# EAGLE design strip (EAGLE 9.2.0)
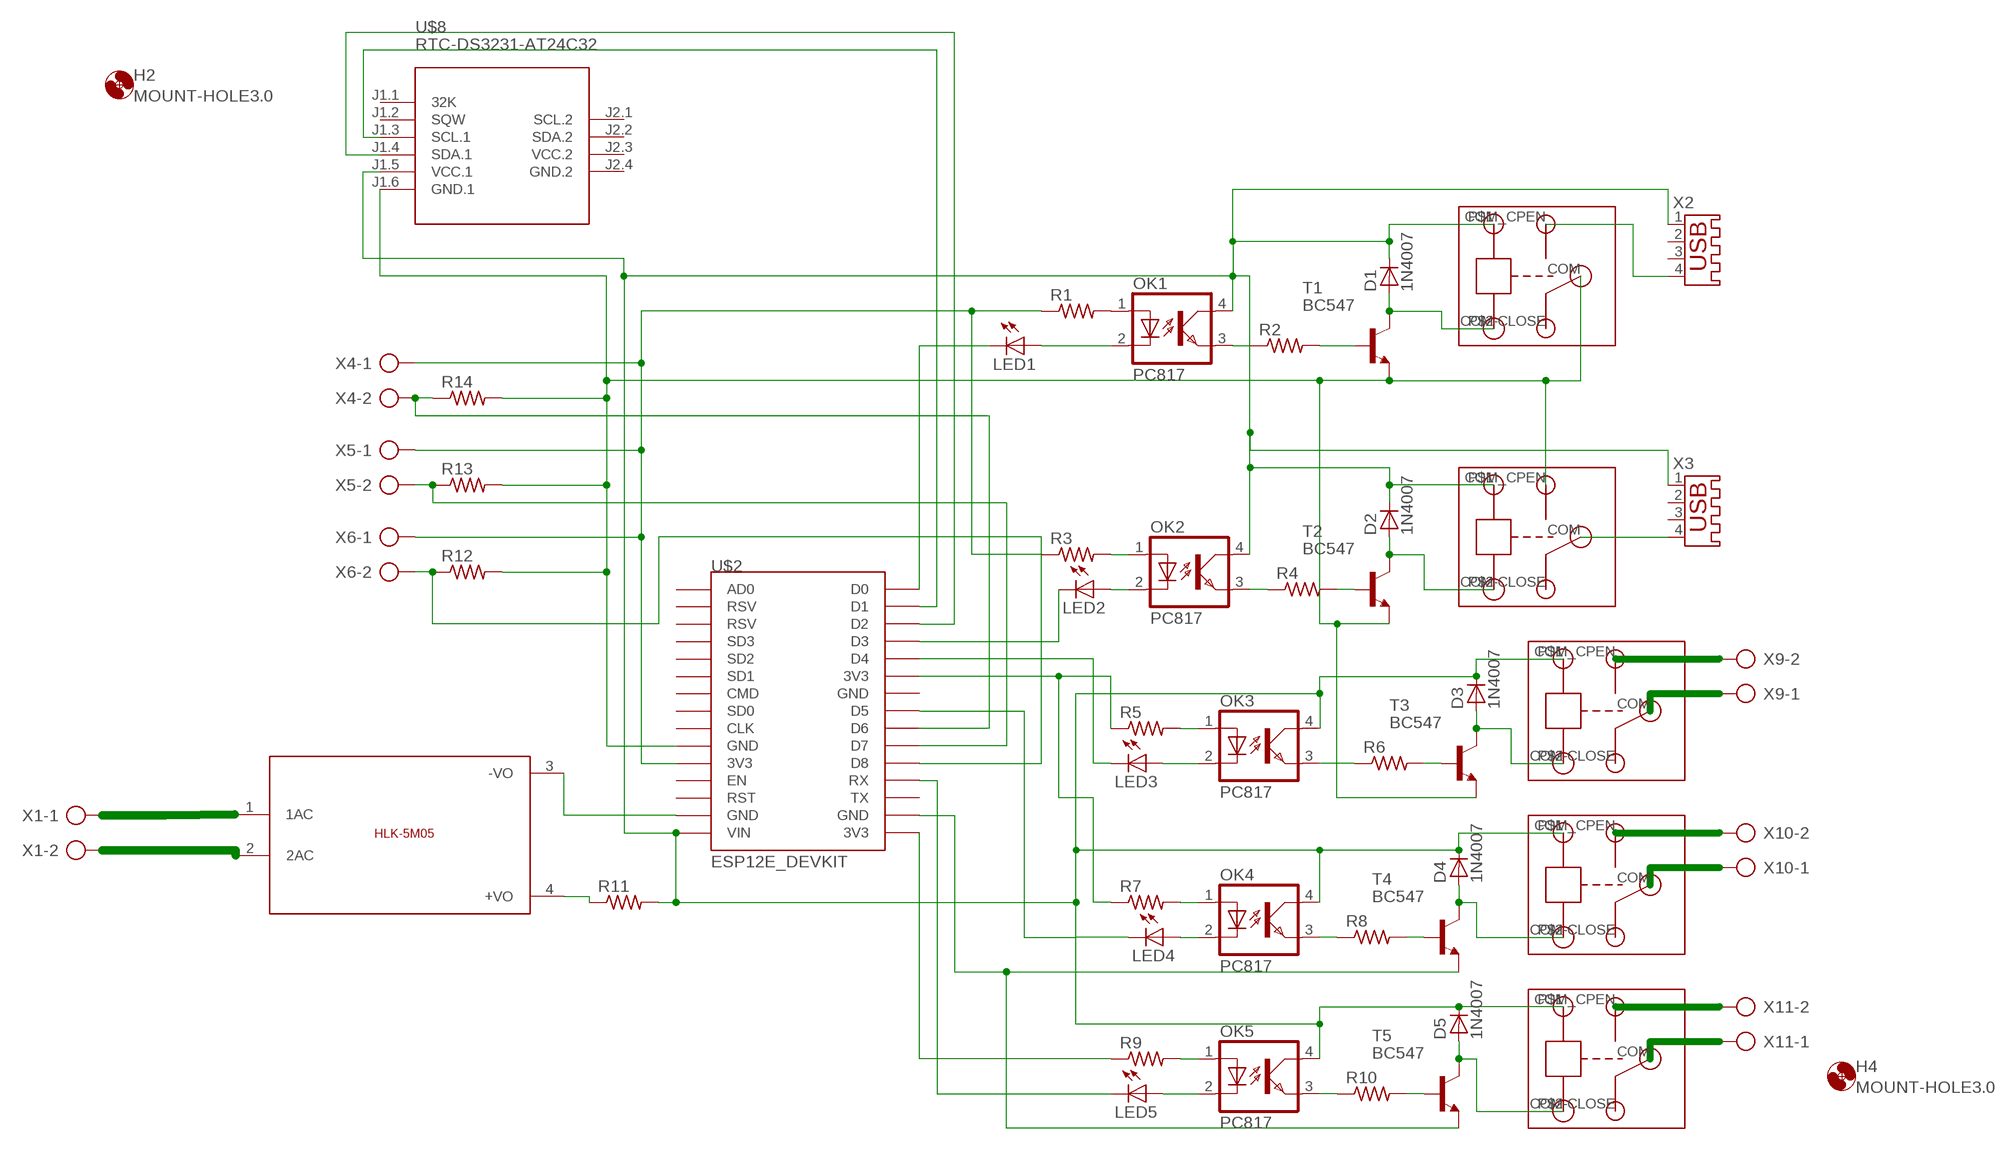
[diagram p0: schematic, sheet 1]

## Parts
D1  1N4007  [SMA]
D2  1N4007  [SMA]
D3  1N4007  [SMA]
D4  1N4007  [SMA]
D5  1N4007  [SMA]
H2  MOUNT-HOLE3.0  [3,0]
H4  MOUNT-HOLE3.0  [3,0]
LED1  LED3MM  [LED3MM]
LED2  LED3MM  [LED3MM]
LED3  LED3MM  [LED3MM]
LED4  LED3MM  [LED3MM]
LED5  LED3MM  [LED3MM]
OK1  PC817  [DIL04]
OK2  PC817  [DIL04]
OK3  PC817  [DIL04]
OK4  PC817  [DIL04]
OK5  PC817  [DIL04]
R1  R-US_0204/5  [0204/5]
R2  R-US_0204/5  [0204/5]
R3  R-US_0204/5  [0204/5]
R4  R-US_0204/5  [0204/5]
R5  R-US_0204/5  [0204/5]
R6  R-US_0204/5  [0204/5]
R7  R-US_0204/5  [0204/5]
R8  R-US_0204/5  [0204/5]
R9  R-US_0204/5  [0204/5]
R10  R-US_0204/5  [0204/5]
R11  R-US_0204/5  [0204/5]
R12  R-US_0204/5  [0204/5]
R13  R-US_0204/5  [0204/5]
R14  R-US_0204/5  [0204/5]
T1  BC547  [TO92]
T2  BC547  [TO92]
T3  BC547  [TO92]
T4  BC547  [TO92]
T5  BC547  [TO92]
U$1  5VDC/5W  HLK-5M05  [HLK-5M05]
U$2  ESP12E_DEVKIT  [ESP12E_DEVKIT]
U$3  RELAY  [RELAY]
U$4  RELAY  [RELAY]
U$5  RELAY  [RELAY]
U$6  RELAY  [RELAY]
U$7  RELAY  [RELAY]
U$8  RTC-DS3231-AT24C32  [RTC-DS3231-AT24C32]
X1  AK300/2  [AK300/2]
X2  USB-A003  [USB-A003]
X3  USB-A003  [USB-A003]
X4  AK300/2  [AK300/2]
X5  AK300/2  [AK300/2]
X6  AK300/2  [AK300/2]
X9  AK300/2  [AK300/2]
X10  AK300/2  [AK300/2]
X11  AK300/2  [AK300/2]

## Nets
N$1: U$1.1(1AC) X1.1
N$2: U$1.2(2AC) X1.2
N$3: R11.1 U$1.4(+VO)
N$4: U$1.3(-VO) U$2.GND@1(GND)
N$5: LED1.A OK1.2(C)
N$6: LED1.K(C) U$2.D0
N$7: OK1.1(A) R1.2
N$8: R1.1 R3.1 U$2.3V3@0(3V3) X4.1 X5.1 X6.1
N$9: D1.K(C) D2.K(C) D3.K(C) D4.K(C) D5.K(C) OK1.4(COL) OK2.4(COL) OK3.4(COL) OK4.4(COL) OK5.4(COL) R11.2 U$2.VIN U$3.P$1(IN) U$4.P$1(IN) U$5.P$1(IN) U$6.P$1(IN) U$7.P$1(IN) U$8.J1.5(VCC.1) X2.1 X3.1
N$10: OK1.3(EMIT) R2.1
N$11: R2.2 T1.2(B)
N$12: R12.2 R13.2 R14.2 T1.1(E) T2.1(E) T3.1(E) U$2.GND@0(GND) U$3.COM U$4.COM_CPEN(COM-OPEN) U$8.J1.6(GND.1)
N$13: D1.A T1.3(C) U$3.P$2(GND)
N$14: U$7.COM_CPEN(COM-OPEN) X11.2
N$15: U$7.COM X11.1
N$16: U$6.COM_CPEN(COM-OPEN) X10.2
N$17: U$6.COM X10.1
N$18: U$5.COM_CPEN(COM-OPEN) X9.2
N$19: U$5.COM X9.1
N$20: U$4.COM X3.4
N$21: R12.1 U$2.D8 X6.2
N$22: U$3.COM_CPEN(COM-OPEN) X2.4
N$23: R13.1 U$2.D7 X5.2
N$24: LED2.A OK2.2(C)
N$25: LED2.K(C) U$2.D3
N$26: OK2.1(A) R3.2
N$27: OK2.3(EMIT) R4.1
N$28: R4.2 T2.2(B)
N$29: D2.A T2.3(C) U$4.P$2(GND)
N$30: LED3.A OK3.2(C)
N$31: LED3.K(C) U$2.D4
N$32: OK3.1(A) R5.2
N$33: OK5.1(A) R9.2
N$34: OK3.3(EMIT) R6.1
N$35: R6.2 T3.2(B)
N$36: D3.A T3.3(C) U$5.P$2(GND)
N$37: LED4.A OK4.2(C)
N$38: OK4.1(A) R7.2
N$39: R5.1 R7.1 U$2.3V3@1(3V3)
N$40: OK4.3(EMIT) R8.1
N$41: R8.2 T4.2(B)
N$42: D4.A T4.3(C) U$6.P$2(GND)
N$43: T4.1(E) T5.1(E) U$2.GND@3(GND)
N$44: OK5.3(EMIT) R10.1
N$45: R10.2 T5.2(B)
N$46: D5.A T5.3(C) U$7.P$2(GND)
N$47: LED5.A OK5.2(C)
N$48: LED4.K(C) U$2.D5
N$49: U$2.D1 U$8.J1.3(SCL.1)
N$50: LED5.K(C) U$2.RX
N$51: R9.1 U$2.3V3@2(3V3)
N$52: U$2.D2 U$8.J1.4(SDA.1)
N$53: R14.1 U$2.D6 X4.2
Unconnected: U$2.AD0 U$2.CLK U$2.CMD U$2.EN U$2.GND@2(GND) U$2.RST U$2.RSV@0(RSV) U$2.RSV@1(RSV) U$2.SD0 U$2.SD1 U$2.SD2 U$2.SD3 U$2.TX U$3.COM-CLOSE U$4.COM-CLOSE U$5.COM-CLOSE U$6.COM-CLOSE U$7.COM-CLOSE U$8.J1.1(32K) U$8.J1.2(SQW) U$8.J2.1(SCL.2) U$8.J2.2(SDA.2) X2.2 X2.3 X3.2 X3.3

## Power pins joined to a net without a drawn wire
GND.2: U$8.J2.4(GND.2)
VCC.2: U$8.J2.3(VCC.2)

## Library data of the parts
D1-D5 = casovac:1N4007
H2 H4 = holes:MOUNT-HOLE: MOUNTING HOLE with drill center marker
LED1-LED5 = led:LED: LED OSRAM: - CHIPLED LG R971, LG N971, LY N971, LG Q971, LY Q971, LO R971, LY R971 LH N974, LH R974 LS Q976, LO Q976, LY Q976 LO Q996 - Hyper CHIPLED LW Q18S LB Q993, LB Q99A, LB R99A - SideLED LS A670, LO A670, LY A670, LG A670, LP A670 LB A673, LV A673, LT A673, LW A673 LH A674 LY A675 LS A676, LA A676, LO A676, LY A676, LW A676 LS A679, LY A679, LG A679 - Hyper Micro SIDELED® LS Y876, LA Y876, LO Y876, LY Y876 LT Y87S - SmartLED LW L88C, LW L88S LB L89C, LB L89S, LG L890 LS L89K, LO L89K, LY L89K LS L896, LA L896, LO L896, LY L896 - TOPLED LS T670, LO T670, LY T670, LG T670, LP T670 LSG T670, LSP T670, LSY T670, LOP T670, LYG T670 LG T671, LOG T671, LSG T671 LB T673, LV T673, LT T673, LW T673 LH T674 LS T676, LA T676, LO T676, LY T676, LB T676, LH T676, LSB T676, LW T676 LB T67C, LV T67C, LT T67C, LS T67K, LO T67K, LY T67K, LW E67C LS E67B, LA E67B, LO E67B, LY E67B, LB E67C, LV E67C, LT E67C LW T67C LS T679, LY T679, LG T679 LS T770, LO T770, LY T770, LG T770, LP T770 LB T773, LV T773, LT T773, LW T773 LH T774 LS E675, LA E675, LY E675, LS T675 LS T776, LA T776, LO T776, LY T776, LB T776 LHGB T686 LT T68C, LB T68C - Hyper Mini TOPLED® LB M676 - Mini TOPLED Santana® LG M470 LS M47K, LO M47K, LY M47K Source: http://www.osram.convergy.de LUXEON: - LUMILED® LXK2-PW12-R00, LXK2-PW12-S00, LXK2-PW14-U00, LXK2-PW14-V00 LXK2-PM12-R00, LXK2-PM12-S00, LXK2-PM14-U00 LXK2-PE12-Q00, LXK2-PE12-R00, LXK2-PE12-S00, LXK2-PE14-T00, LXK2-PE14-U00 LXK2-PB12-K00, LXK2-PB12-L00, LXK2-PB12-M00, LXK2-PB14-N00, LXK2-PB14-P00, LXK2-PB14-Q00 LXK2-PR12-L00, LXK2-PR12-M00, LXK2-PR14-Q00, LXK2-PR14-R00 LXK2-PD12-Q00, LXK2-PD12-R00, LXK2-PD12-S00 LXK2-PH12-R00, LXK2-PH12-S00 LXK2-PL12-P00, LXK2-PL12-Q00, LXK2-PL12-R00 Source: www.luxeon.com KINGBRIGHT: KA-3528ASYC Source: www.kingbright.com
OK1-OK5 = optocoupler:PC817: SHARP OPTO COUPLER; MPN: PC817X4J000F; OC_FARNELL: 9707727; OC_NEWARK: 97K7059
R1-R10 R12-R14 = resistor:R-US_: RESISTOR, American symbol
R11 = rcl:R-US_: RESISTOR, American symbol; SPICEPREFIX: R
T1-T5 = transistor-neu-to92:BC547: NPN TRANSISTOR
U$1 = HLK-5M05:HLK-5M05: HLK-5M05 is an 5Volt/5W smps developed by HI-LINK; SIZE: 23x38(mm)
U$2 = ESP12E_DEVKIT:ESP12E_DEVKIT: ESP12E DEVKIT BOARD
U$3-U$7 = RELAY:RELAY
U$8 = diy-modules:RTC-DS3231-AT24C32: RTC Module with Battery and EEPROM based on DS3231 and AT24C32 chips Tutorial can be found here: https://edwardmallon.wordpress.com/2014/05/21/using-a-cheap-3-ds3231-rtc-at24c32-eeprom-from-ebay/ Click here to find device on ebay.com <http://www.ebay.com/sch/DS3231+AT24C32+module>
X1 X4-X6 X9-X11 = con-ptr500:AK300/2: CONNECTOR; OC_FARNELL: unknown; OC_NEWARK: unknown
X2 X3 = con-yamaichi:USB-A003: USB connector; OC_FARNELL: unknown; OC_NEWARK: unknown

## Board
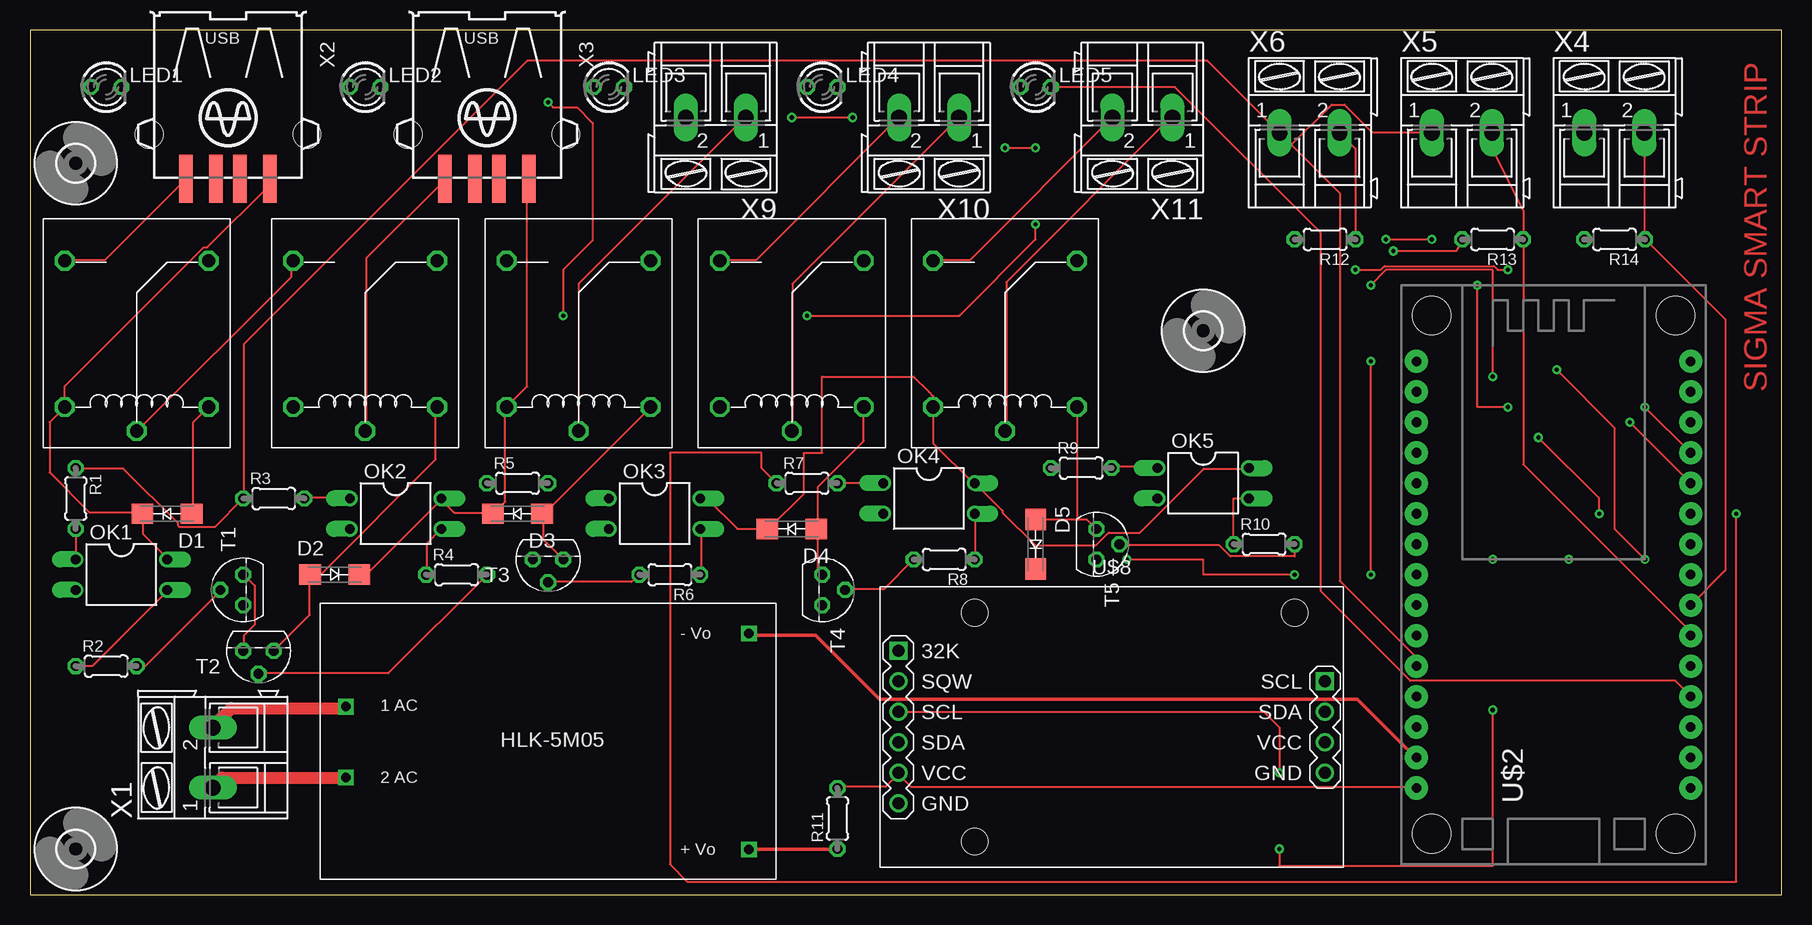
[diagram p1: board, top side]
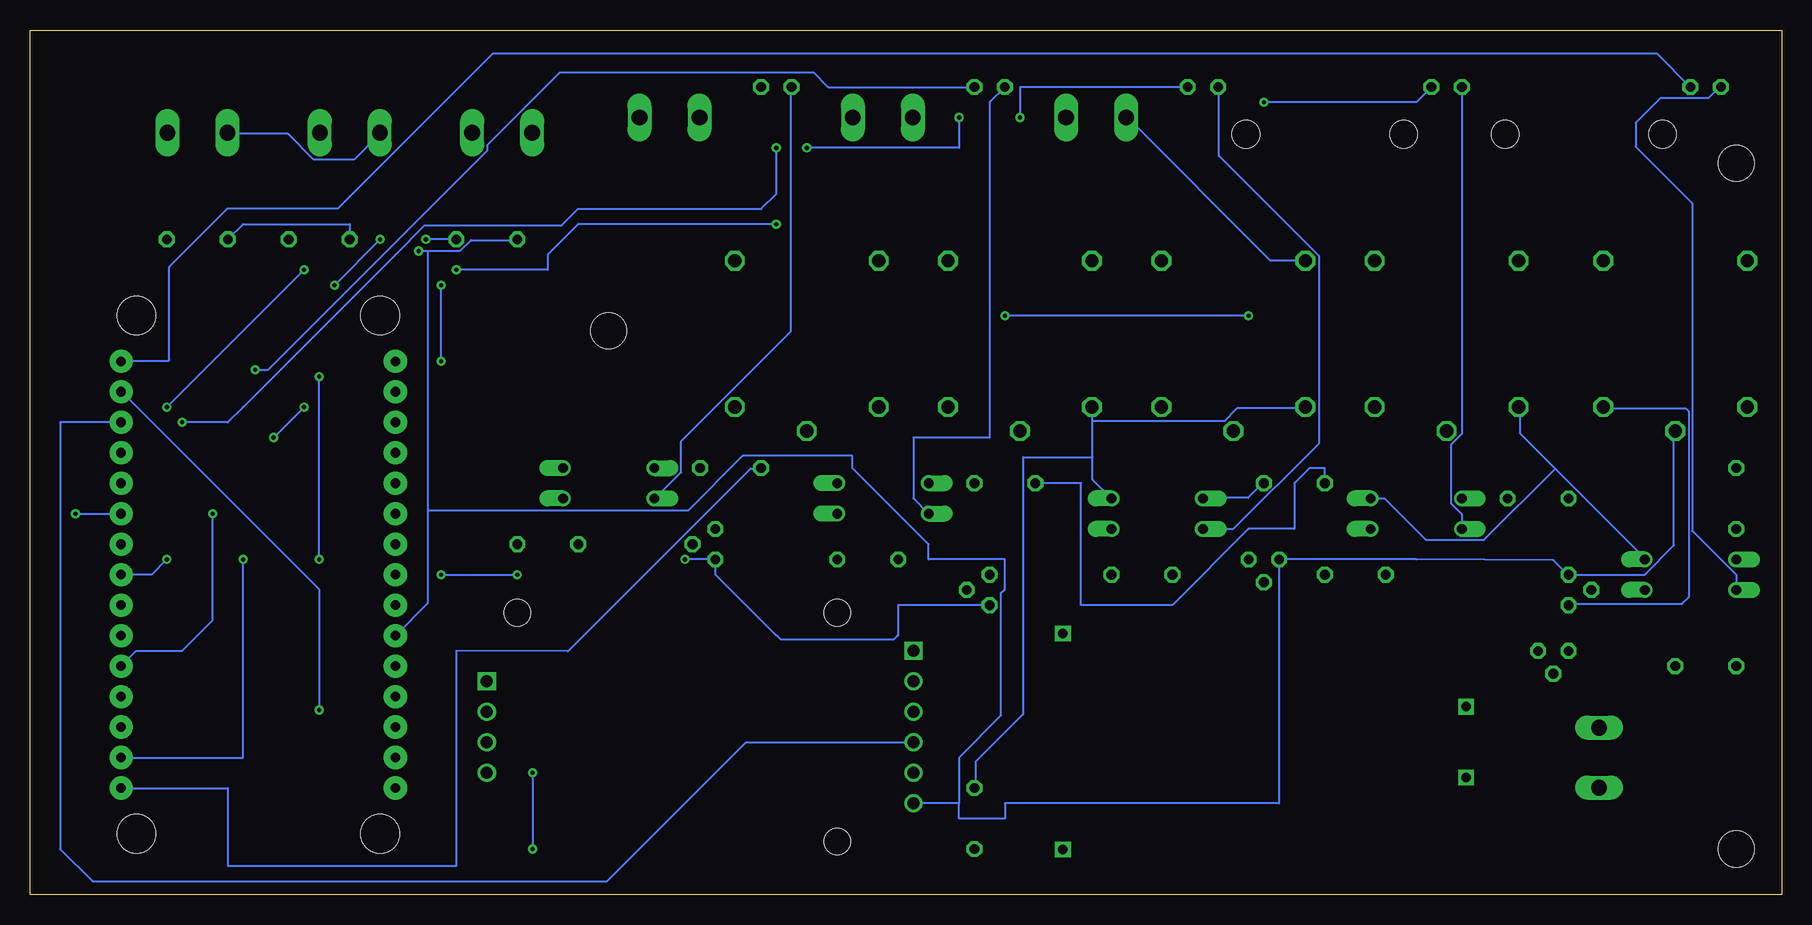
[diagram p2: board, bottom side, seen from below]

Size 146.03 x 72.06 mm. Coordinates in mm from the lower left corner, seen from the top.
Outline: 0,0 146.03,0 146.03,72.06 0,72.06 0,0
Copper layers (1*16): Top 0.035mm / dielectric 1.5mm / Bottom 0.035mm
Design rules "default": minimum track width 6mil, minimum drill 0.35mm, track to track 6mil, track to pad 6mil, pad to pad 6mil, via to via 6mil, smd to smd 6mil, copper to edge 40mil, drill to drill 6mil, minimum pad ring 10mil, minimum via ring 8mil, stop-mask expansion 4mil, vias tented up to drill 0mil, thermal gap 10mil

### Footprints (pad centres in the part's own frame; a part is rotated, then mirrored left to right if it is on the bottom)
SMA = smd 1.8 x 1.7: A -2.05,0; K 2.05,0
3,0 = hole 3: 0,0
LED3MM = drill 0.813 octagon: A -1.27,0; K 1.27,0
DIL04 = drill 0.813 offset: 1 -1.27,-3.81; 2 1.27,-3.81; 3 1.27,3.81; 4 -1.27,3.81
0204/5 = drill 0.813 octagon: 1 -2.54,0; 2 2.54,0
TO92 = drill 0.813 octagon: 1 1.27,0; 2 0,1.905; 3 -1.27,0
HLK-5M05 = drill 0.8 square: 1 -16.85,-2.93; 2 -16.85,2.97; 3 16.75,9.07; 4 16.75,-8.93
ESP12E_DEVKIT = drill 0.8 pad 1.93: 3V3@0 -11.43,-7.62; 3V3@1 11.43,5.08; 3V3@2 11.43,-17.78; AD0 -11.43,17.78; CLK -11.43,-2.54; CMD -11.43,2.54; D0 11.43,17.78; D1 11.43,15.24; D2 11.43,12.7; D3 11.43,10.16; D4 11.43,7.62; D5 11.43,0; D6 11.43,-2.54; D7 11.43,-5.08; D8 11.43,-7.62; EN -11.43,-10.16; GND@0 -11.43,-5.08; GND@1 -11.43,-15.24; GND@2 11.43,2.54; GND@3 11.43,-15.24; RST -11.43,-12.7; RSV@0 -11.43,15.24; RSV@1 -11.43,12.7; RX 11.43,-10.16; SD0 -11.43,0; SD1 -11.43,5.08; SD2 -11.43,7.62; SD3 -11.43,10.16; TX 11.43,-12.7; VIN -11.43,-17.78 | hole 3.2: -10.16,21.59; 10.16,21.59; 10.16,-21.59; -10.16,-21.59
RELAY = drill 1.1 octagon: COM -2,0; COM-CLOSE 12.2,-6; COM_CPEN 12.2,6; P$1 0,6; P$2 0,-6
RTC-DS3231-AT24C32 = drill 1 square: J1.1 -17.78,6.35; J2.1 17.78,3.81 | drill 1: J1.2 -17.78,3.81; J1.3 -17.78,1.27; J1.4 -17.78,-1.27; J1.5 -17.78,-3.81; J1.6 -17.78,-6.35; J2.2 17.78,1.27; J2.3 17.78,-1.27; J2.4 17.78,-3.81 | hole 2.2: -11.43,-9.525; -11.43,9.525; 15.24,9.525
AK300/2 = drill 1.321 long: 1 -2.515,0; 2 2.489,0
USB-A003 = smd 1.12 x 4: 1 -3.5,14; 2 -1,14; 3 1,14; 4 3.5,14 | hole 2.3: -6.57,10.28; 6.57,10.28

### Placement (x,y rotation side)
D1  11.43,31.75 180 top
D2  25.4,26.67 0 top
D3  40.64,31.75 180 top
D4  63.5,30.48 180 top
D5  83.82,29.21 270 top
H2  97.79,46.99 0 top
H3  MOUNT-HOLE3.0  [3,0]  3.81,60.96 0 top
H4  3.81,3.81 0 top
LED1  6.35,67.31 0 top
LED2  27.94,67.31 0 top
LED3  48.26,67.31 0 top
LED4  66.04,67.31 0 top
LED5  83.82,67.31 0 top
OK1  7.62,26.67 270 top
OK2  30.48,31.75 270 top
OK3  52.07,31.75 270 top
OK4  74.93,33.02 270 top
OK5  97.79,34.29 270 top
R1  3.81,33.02 270 top
R2  6.35,19.05 0 top
R3  20.32,33.02 0 top
R4  35.56,26.67 0 top
R5  40.64,34.29 0 top
R6  53.34,26.67 180 top
R7  64.77,34.29 0 top
R8  76.2,27.94 180 top
R9  87.63,35.56 0 top
R10  102.87,29.21 0 top
R11  67.31,6.35 90 top
R12  107.95,54.61 180 top
R13  121.92,54.61 180 top
R14  132.08,54.61 180 top
T1  17.78,25.4 90 top
T2  19.05,20.32 180 top
T3  43.18,27.94 180 top
T4  66.04,25.4 270 top
T5  88.9,29.21 270 top
U$1  43.18,12.7 0 top
U$2  127,26.67 0 top
U$3  8.89,40.64 90 top
U$4  27.94,40.64 90 top
U$5  45.72,40.64 90 top
U$6  63.5,40.64 90 top
U$7  81.28,40.64 90 top
U$8  90.17,13.97 0 top
X1  15.24,11.43 90 top
X2  16.51,73.66 180 top
X3  38.1,73.66 180 top
X4  132.08,63.5 0 top
X5  119.38,63.5 0 top
X6  106.68,63.5 0 top
X9  57.15,64.77 180 top
X10  74.93,64.77 180 top
X11  92.71,64.77 180 top

### Tracks (layer width: path | path; a pad name or v marks a point on that pad's centre or on a via)
N$1
  Top 1.016: U$1.1 26.21,9.75 16,9.75 15.24,8.99 X1.1
N$2
  Top 1.016: U$1.2 26.21,15.54 16.76,15.54 15.24,14.02 X1.2
N$3
  Top 0.152: 60.05,3.81 U$1.4
  Top 0.305: R11.1 60.05,3.81
N$4
  Top 0.152: 60.05,21.64 U$1.3
  Top 0.305: 60.05,21.64 65.48,21.64 70.81,16.31 110.64,16.31 115.52,11.43 U$2.GND@1
N$5
  Bottom 0.152: OK1.2 3.81,26.67 7.47,30.33 7.47,57.61 12.19,62.33 12.19,64.31 10.11,66.4 6.1,66.4 5.18,67.31 LED1.A
N$6
  Bottom 0.152: LED1.K 10.41,70.1 107.44,70.1 120.34,57.2 129.54,57.2 134.42,52.32 134.42,44.55 134.47,44.5 138.38,44.5 U$2.D0
N$7
  Top 0.152: R1.2 OK1.1
N$8
  Top 0.152: R1.1 3.81,35.51 7.77,35.51 12.34,30.94 12.34,30.79 12.5,30.63 15.39,30.63 R3.1 17.83,33.07 17.83,45.87 41.45,69.49 98.15,69.49 104.09,63.55 X6.1 104.24,63.4 105.16,62.48 | 105.16,62.48 109.17,58.47 109.17,26.16 115.52,19.81 115.52,19.05 U$2.3V3@0 | 105.16,62.48 108.51,65.84 109.58,65.84 111.86,63.55 116.74,63.55 X5.1
  Bottom 0.152: X4.1 129.54,63.4 124.51,63.4 122.38,61.27 119.02,61.27 116.89,63.4 X5.1
N$9
  Top 0.152: OK1.4 11.43,28.04 9.45,30.02 9.45,31.7 D1.K 9.3,31.85 4.98,31.85 1.63,35.2 1.63,39.38 U$3.P$1 2.9,40.69 2.9,42.37 14.48,53.95 14.78,53.95 19.96,59.13 19.96,59.59 X2.1 | 72.39,10.06 71.32,8.99 67.36,8.99 R11.2 | 72.39,10.06 73.46,8.99 115.52,8.99 U$2.VIN | 72.39,10.06 U$8.J1.5 | 83.82,29.11 D5.K | 83.82,29.11 81.08,31.85 81.08,32 78.79,34.29 OK4.4 78.64,34.29 75.29,37.64 75.29,41.55 75.28,41.56 | 83.82,29.11 88.85,29.11 89.92,30.18 92.51,30.18 97.84,35.51 101.5,35.51 OK5.4 | OK3.4 55.93,32.92 56.54,32.92 58.98,30.48 D4.K 61.57,30.48 64.52,33.43 64.52,36.83 66.04,36.83 66.04,43.18 73.66,43.18 74.93,41.91 75.28,41.56 | D2.K 28.04,26.67 34.29,32.92 | 34.29,32.92 35.36,31.85 38.56,31.85 D3.K 38.71,31.85 39.62,32.77 39.62,40.54 U$5.P$1 39.78,40.69 41.45,42.37 41.45,59.59 X3.1 | 34.29,32.92 OK2.4 | U$7.P$1 75.28,41.56
  Bottom 0.152: 18.9,35.51 11.43,28.04 OK1.4 | 18.9,35.51 21.79,38.41 21.79,40.54 U$4.P$1 | 57.45,36.47 57.45,34.59 OK3.4 | 57.45,36.47 57.45,39.47 | 57.45,39.47 57.45,40.54 U$6.P$1 | 57.45,39.47 46.48,39.47 45.41,40.54 39.78,40.54 U$5.P$1 | 57.45,36.47 63.25,36.47 63.25,15.04 67.21,11.07 67.21,8.99 R11.2 | 18.9,35.51 24.84,29.57 29.67,29.57 33.12,33.02 OK2.4
N$10
  Top 0.152: R2.1 5.18,19.05 11.43,25.3 OK1.3
N$11
  Top 0.152: R2.2 9.6,19.05 15.85,25.3 T1.2
N$12  (via drill 0.35)
  Top 0.152: R13.2 118.9,53.65 v113.64,53.65 | T2.1 17.83,20.42 17.83,21.59 18.75,22.5 18.75,25.76 17.83,26.67 T1.1 | U$4.COM_CPEN 21.79,52.73 21.79,51.51 8.99,38.71 U$3.COM
  Bottom 0.152: v113.64,53.65 112.88,53.65 | 112.88,53.65 110.19,53.65 109.27,54.56 105.46,54.56 R12.2 | U$2.GND@0 112.88,24.28 112.88,32 | 112.88,53.65 112.88,32 | U$3.COM 8.99,38.56 8.99,29.11 11.43,26.67 T1.1 17.83,26.67 19.05,27.89 30.48,27.94 T3.1 41.91,7.62 64.77,7.62 64.77,6.35 68.58,6.35 68.58,7.62 | 112.88,32 91.19,32 86.61,36.58 77.47,36.58 77.47,35.56 71.12,29.21 71.12,27.94 64.77,27.94 64.77,25.4 64.82,25.4 65.08,25.15 65.08,14.94 68.58,11.43 68.58,7.62 | R14.2 128.27,55.88 119.38,55.88 R13.2 | 68.58,7.62 U$8.J1.6
N$13
  Top 0.152: D1.A 13.56,31.85 13.56,39.32 14.78,40.54 U$3.P$2
  Bottom 0.152: T1.3 17.68,24.23 8.33,24.23 7.77,24.79 7.77,40.28 8.03,40.54 14.78,40.54 U$3.P$2
N$14
  Top 0.152: X11.2 78.33,52.88 75.29,52.88 U$7.COM_CPEN
N$15
  Top 0.152: U$7.COM 81.38,38.71 81.38,51.05 95.1,64.77 X11.1
N$16
  Top 0.152: U$6.COM_CPEN 57.61,52.88 60.5,52.88 72.39,64.77 X10.2
N$17
  Top 0.152: U$6.COM 63.55,38.71 63.55,50.9 77.42,64.77 X10.1
N$18
  Bottom 0.152: U$5.COM_CPEN 39.78,52.88 42.67,52.88 54.56,64.77 X9.2
N$19
  Top 0.152: U$5.COM 45.72,50.9 59.59,64.77 X9.1
N$20
  Top 0.152: U$4.COM 28.04,38.71 28.04,53.03 34.59,59.59 X3.4
N$21  (via drill 0.35)
  Top 0.152: R12.1 110.49,62.18 X6.2 | v130.81,31.75 130.81,33.02 v125.73,38.1 | v120.65,50.8 120.65,40.64 v123.19,40.64 | v113.03,54.61 v116.84,54.61
  Bottom 0.152: U$2.D8 137.16,20.32 133.35,20.32 130.81,22.86 v130.81,31.75 | v125.73,38.1 v123.19,40.64 | R12.1 v113.03,54.61 | v116.84,54.61 v120.65,50.8
N$22
  Top 0.152: U$3.COM_CPEN 2.9,52.88 6.25,52.88 12.95,59.59 X2.4
N$23
  Top 0.152: X5.2 121.87,62.23 124.46,57.05 R13.1 124.46,35.87 138.38,21.95 138.38,21.64 U$2.D7
N$24
  Bottom 0.152: OK2.2 26.67,31.7 27.58,32.61 27.58,37.49 26.67,38.41 LED2.A
N$25  (via drill 0.35)
  Top 0.152: v43.18,66.04 43.6,65.62 45.6,65.62 46.91,64.31 46.91,54.53 44.45,52.07 v44.45,48.26 | v64.77,48.26 77.47,48.26 83.82,54.61 v83.82,55.88 | v110.49,52.07 112.6,52.07 112.9,52.38 122.05,52.38 122.35,52.07 v123.19,52.07 | v134.62,40.64 U$2.D3
  Bottom 0.152: LED2.K 30.48,66.04 v43.18,66.04 | v44.45,48.26 v64.77,48.26 | v83.82,55.88 100.33,55.88 102.87,53.34 102.87,52.07 v110.49,52.07 | v123.19,52.07 v134.62,40.64
N$26
  Top 0.152: R3.2 22.86,33.07 26.67,33.07 OK2.1
N$27
  Top 0.152: OK2.3 33.07,29.26 33.07,26.67 R4.1
N$28
  Top 0.152: R4.2 29.87,18.44 19.05,18.44 T2.2
N$29
  Top 0.152: T2.3 23.32,23.32 23.32,26.67 D2.A 24.23,26.67 33.83,36.27 33.83,40.54 U$4.P$2
N$30
  Bottom 0.152: OK3.2 45.72,30.48 38.56,37.64 38.56,53.19 46.94,61.57 46.94,67.31 LED3.A
N$31  (via drill 0.35)
  Top 0.152: v133.35,39.37 U$2.D4 | v63.5,64.77 v68.58,64.77 | v81.28,62.23 v83.82,62.23
  Bottom 0.152: v133.35,39.37 129.54,39.37 128.27,40.64 115.57,53.34 113.13,55.78 101.7,55.78 100.33,57.15 85.09,57.15 83.82,58.42 v83.82,62.23 | v63.5,64.77 63.5,67.31 LED3.K | v68.58,64.77 68.58,62.23 v81.28,62.23
N$32
  Bottom 0.152: OK3.1 48.16,33.07 44.5,33.07 43.28,34.29 R5.2
N$33
  Top 0.152: R9.2 90.22,35.66 93.88,35.66 OK5.1
N$34
  Top 0.152: R6.1 55.93,26.67 55.93,30.48 OK3.3
N$35
  Top 0.152: T3.2 43.28,26.06 50.14,26.06 50.75,26.67 R6.2
N$36
  Top 0.152: 42.82,31.7 42.82,29.57 T3.3 | 42.82,31.7 51.66,40.54 U$5.P$2 | 42.82,31.7 D3.A
N$37
  Bottom 0.152: LED4.A 66.04,66.04 66.04,38.1 72.39,38.1 72.39,33.02 OK4.2
N$38
  Top 0.152: OK4.1 R7.2
N$39  (via drill 0.35)
  Top 0.152: R7.1 60.96,35.56 60.96,36.83 53.34,36.83 53.34,2.54 54.79,1.09 142.24,1.09 v142.24,31.75
  Bottom 0.152: 62.33,34.29 R7.1 58.42,34.29 58.42,24.13 50.8,24.13 44.45,30.48 40.64,30.48 40.64,34.29 39.37,35.56 38.1,35.56 R5.1 | v142.24,31.75 U$2.3V3@1
N$40
  Top 0.152: R8.1 78.79,28.04 78.79,31.7 OK4.3
N$41
  Top 0.152: R8.2 71.17,25.45 67.97,25.45 T4.2
N$42
  Top 0.152: 65.68,30.48 65.68,26.98 65.99,26.67 T4.3 | 65.68,30.48 65.68,33.98 69.49,37.8 69.49,40.54 U$6.P$2 | 65.68,30.48 D4.A
N$43  (via drill 0.35)
  Top 0.152: v128.27,27.94 v121.92,27.94 | v121.92,43.18 121.92,52.07 113.03,52.07 v111.76,50.8 | v91.44,27.94 97.79,27.94 97.79,26.67 v105.41,26.67 | v111.76,26.67 v111.76,44.45
  Bottom 0.152: v128.27,27.94 128.27,11.43 U$2.GND@3 | v121.92,27.94 v121.92,43.18 | v111.76,26.67 v105.41,26.67 | v111.76,44.45 v111.76,50.8 | v91.44,27.94 T5.1 88.9,26.67 83.82,21.59 83.75,21.59 83.46,21.3 74.02,21.3 73.73,21.59 73.66,21.59 73.66,24.13 T4.1
N$44  (via drill 0.35)
  Top 0.152: R10.1 100.33,33.02 OK5.3
  other vias: 100.33,29.21
N$45
  Top 0.152: T5.2 90.83,29.11 99.16,29.11 100.08,28.19 105.41,28.19 R10.2
N$46
  Top 0.152: 87.33,31.24 88.09,31.24 88.85,30.48 T5.3 | 87.33,31.24 83.82,31.24 D5.A | 87.33,31.24 87.33,40.54 U$7.P$2
N$47
  Bottom 0.152: LED5.A 82.6,67.31 82.6,46.94 91.75,37.8 91.75,35.2 93.88,33.07 OK5.2
N$48  (via drill 0.35)
  Top 0.152: v127.25,43.74 132.08,38.91 132.08,30.48 v134.62,27.94
  Bottom 0.152: LED4.K 79.5,67.31 80.72,68.53 101.85,68.53 107.9,62.48 107.9,62.03 126.19,43.74 v127.25,43.74 | v134.62,27.94 135.89,26.67 U$2.D5
N$49  (via drill 0.35)
  Top 0.152: U$8.J1.3 102.87,15.24 104.14,13.97 v104.14,10.16 | v104.14,3.81 104.14,2.39 121.92,2.39 v121.92,15.39
  Bottom 0.152: v121.92,15.39 121.92,25.45 138.38,41.91 U$2.D1 | v104.14,10.16 v104.14,3.81
N$50
  Top 0.152: LED5.K 95.45,67.31 107.59,55.17 107.59,25.3 115.06,17.83 137.16,17.83 138.38,16.61 U$2.RX
N$51
  Bottom 0.152: R9.1 85.19,35.51 85.95,35.51 101.19,20.27 110.49,20.32 110.49,2.39 129.54,2.39 129.54,8.89 U$2.3V3@2
N$52
  Bottom 0.152: U$2.D2 143.51,39.37 143.51,3.81 140.82,1.12 97.94,1.12 86.36,12.7 U$8.J1.4
N$53
  Top 0.152: X4.2 134.57,54.71 R14.1 134.72,54.56 141.33,47.95 141.33,27.03 U$2.D6

### Text on the board
Top: SIGMA SMART STRIP